# EAGLE design Own_21700_Board_v1.0_Final_AR (EAGLE 9.6.2)
COMPANY: ADAFRUIT INDUSTRIES; DRAWN: KTOWN; REV: A; YEAR: 2019
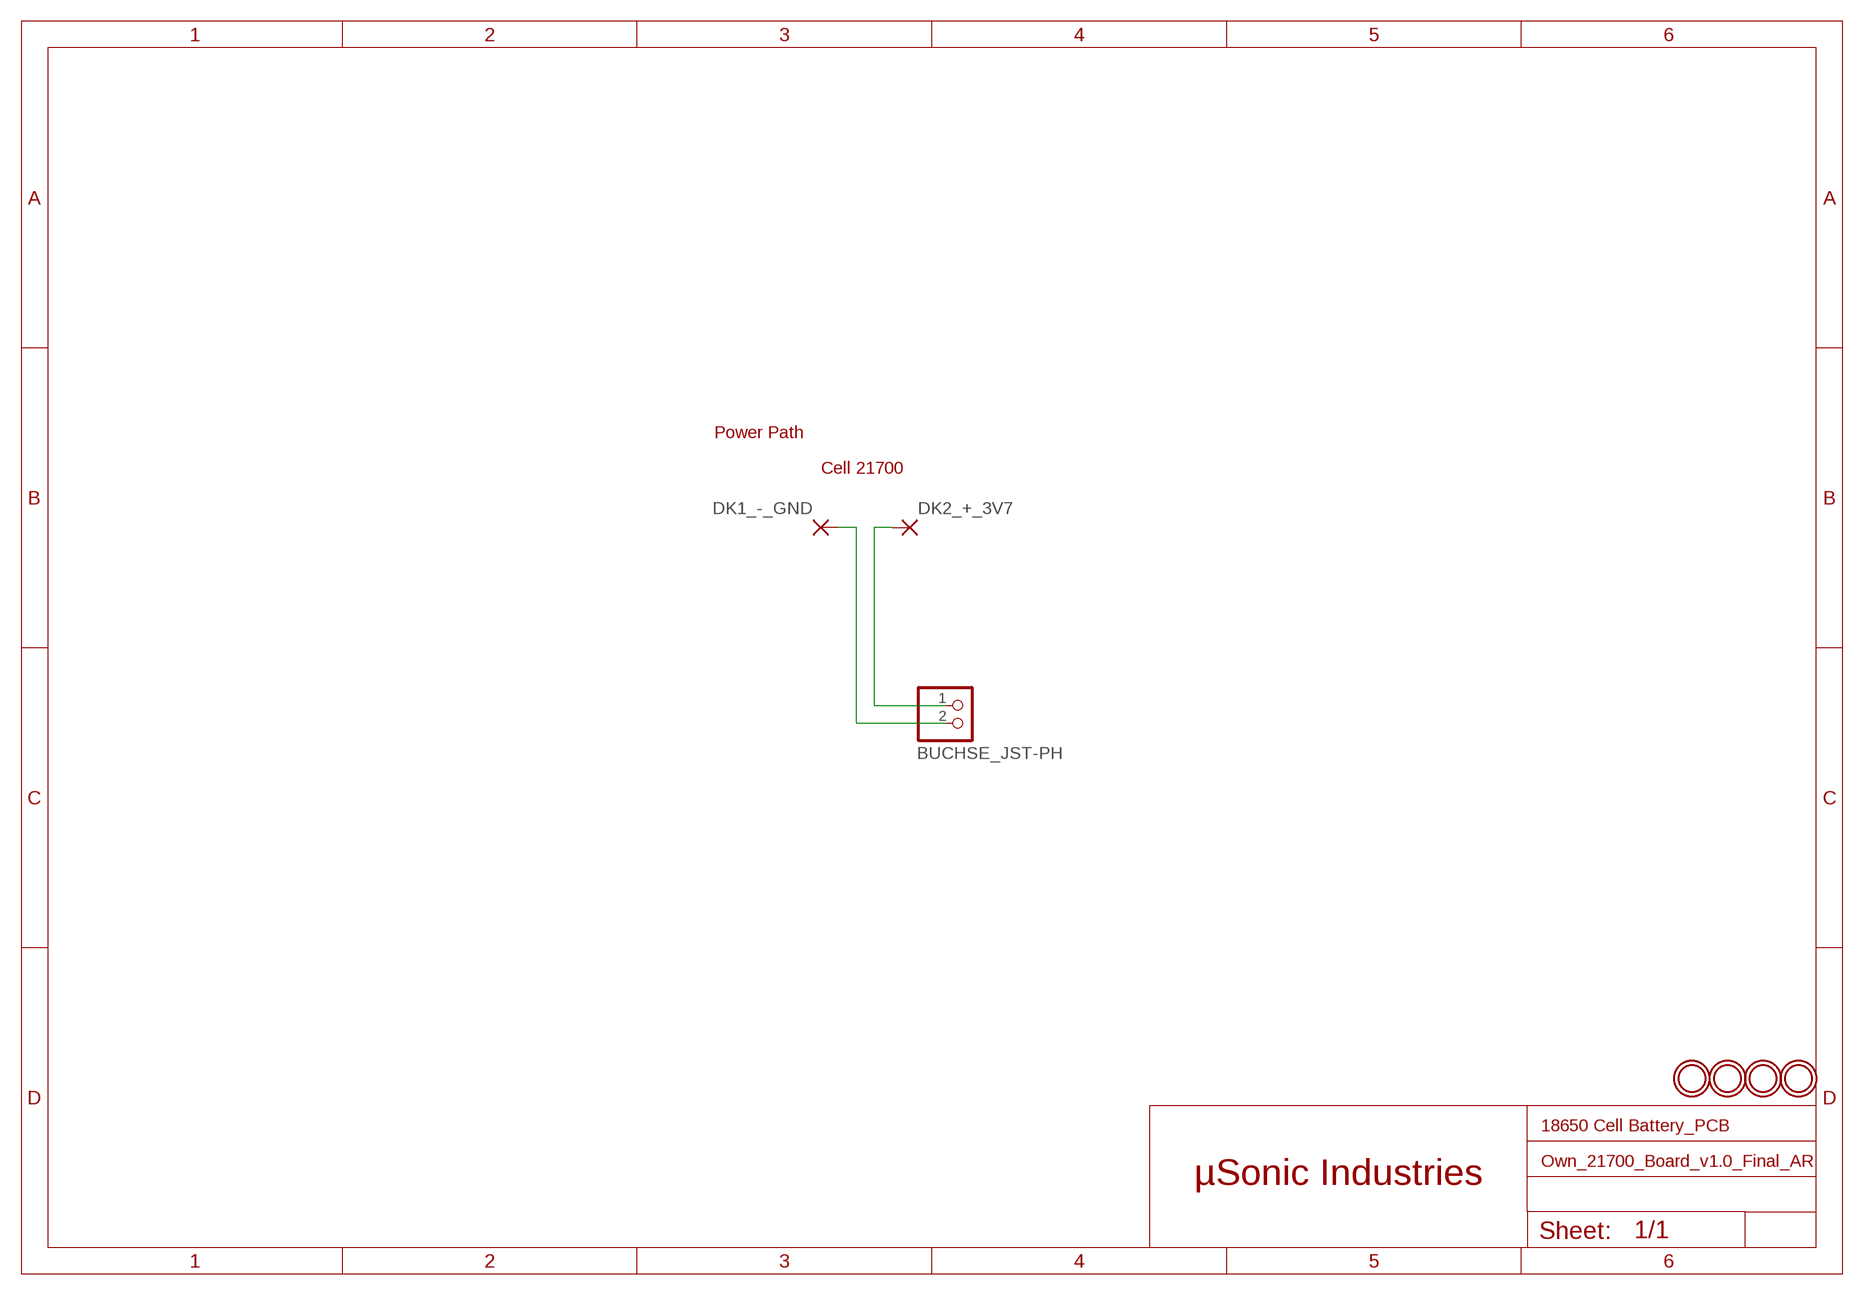
[diagram p0: schematic, sheet 1]

## Parts
BUCHSE_JST-PH  JST_2PINOWN  [JST-PH-2-THMOWN]
DK1_-_GND  3,17/1,3  [3,17/1,3]
DK2_+_3V7  3,17/1,3  [3,17/1,3]
U$1  MOUNTINGHOLE2.5  [MOUNTINGHOLE_2.5_PLATED]
U$2  MOUNTINGHOLE2.5  [MOUNTINGHOLE_2.5_PLATED]
U$3  MOUNTINGHOLE2.5  [MOUNTINGHOLE_2.5_PLATED]
U$5  MOUNTINGHOLE2.5  [MOUNTINGHOLE_2.5_PLATED]

## Nets
3V7: BUCHSE_JST-PH.1 DK2_+_3V7.1(P)
GND: BUCHSE_JST-PH.2 DK1_-_GND.1(P)

## Notes on the sheet
- Power Path
- Cell 21700
- 18650 Cell Battery_PCB
- µSonic Industries

## Library data of the parts
BUCHSE_JST-PH = adafruit2:JST_2PIN: JST 2-Pin Connectors of various flavors SMT-RA (S2B-PH-SM4) 4UConnector #17311 SMT (B2B-PH-SM4) THM-RA (S2B-PH) THM (B2B-PH)
DK1_-_GND DK2_+_3V7 = wirepad:3,17/1,3: THROUGH-HOLE PAD
U$1-U$3 U$5 = microbuilder:MOUNTINGHOLE: Mounting Hole For #2 screws (0.086"/2.18mm width, 0.094"/2.4mm hole) use 2.5mm; BOM: EXCLUDE

## Net classes
0 default: width 0.25 mm

## Board
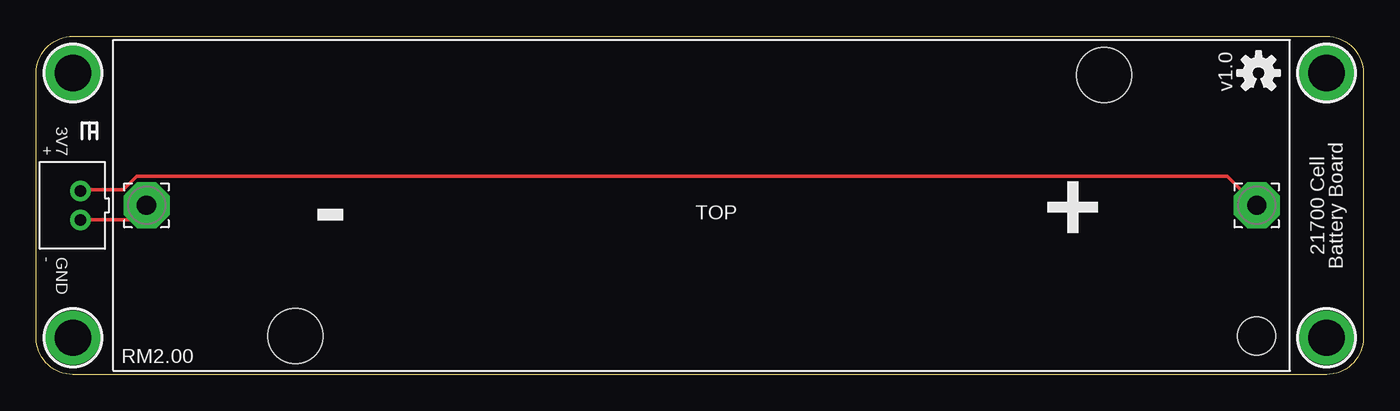
[diagram p1: board, top side]
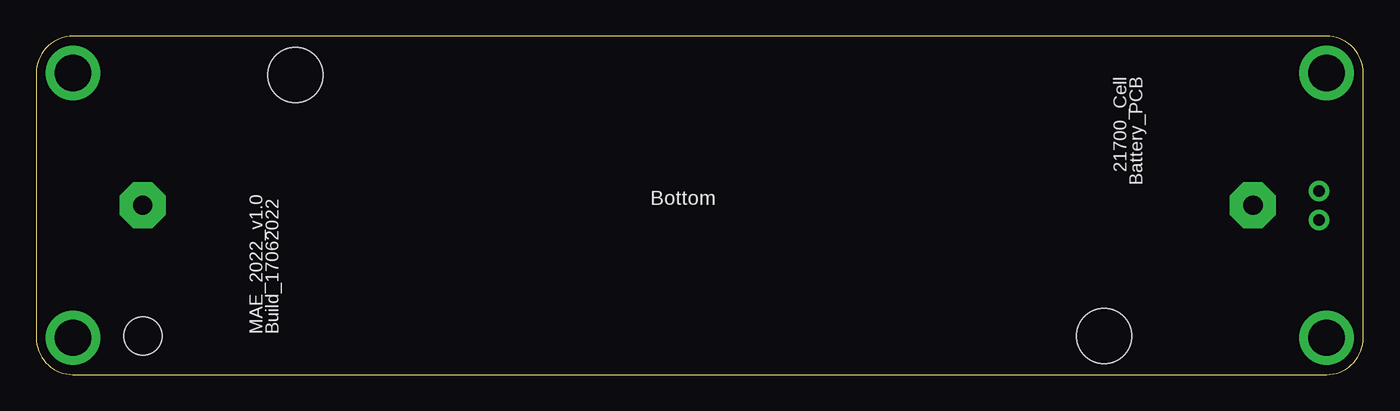
[diagram p2: board, bottom side, seen from below]

Size 91.69 x 23.37 mm. Coordinates in mm from the lower left corner, seen from the top.
Outline: 91.69,20.83 91.69,2.54 arc-90 89.15,0 2.54,0 arc-90 0,2.54 0,20.83 arc-90 2.54,23.37 89.15,23.37 arc-90 91.69,20.83
Copper layers (1*16): Top 0.035mm / dielectric 1.5mm / Bottom 0.035mm
Design rules "aisler_2_layer_complex": minimum track width 0.125mm, minimum drill 0.2mm, track to track 0.125mm, track to pad 0.125mm, pad to pad 0.125mm, via to via 0.125mm, smd to smd 0.125mm, copper to edge 0.3mm, drill to drill 0.25mm, minimum pad ring 0.2mm, minimum via ring 0.2mm, stop-mask expansion 0mil, vias tented up to drill 0mil, thermal gap 10mil
Holes 2.64 mm at 84.33,2.67
Holes 3.8 mm at 73.79,20.7 17.91,2.67

### Footprints (pad centres in the part's own frame; a part is rotated, then mirrored left to right if it is on the bottom)
JST-PH-2-THMOWN = drill 0.8 pad 1.422: 1 1,0; 2 -1,0
3,17/1,3 = drill 1.321 pad 3.175 octagon: 1 0,0
MOUNTINGHOLE_2.5_PLATED = drill 2.5 pad 3.2: P$1 0,0

### Placement (x,y rotation side)
BUCHSE_JST-PH  3.05,11.68 90 top
DK1_-_GND  7.62,11.68 0 top
DK2_+_3V7  84.33,11.68 0 top
U$1  89.15,20.83 180 top
U$2  2.54,20.83 180 top
U$3  89.15,2.54 0 top
U$4  [OSHW-LOGO-S]  84.45,20.83 0 top
U$5  2.54,2.54 0 top

### Tracks (layer width: path | path; a pad name or v marks a point on that pad's centre or on a via)
3V7
  Top 0.25: BUCHSE_JST-PH.1 3.19,12.75 6,12.75 6.94,13.69 82.31,13.69 84.19,11.81 DK2_+_3V7.1
GND
  Top 0.25: BUCHSE_JST-PH.2 3.19,10.69 6.56,10.69 7.5,11.62 DK1_-_GND.1

### Text on the board
tPlace: v1.0 | 3V7 / + | - | TOP | + | 21700 Cell / Battery Board | GND / - | RM2.00
bPlace: 21700_Cell / Battery_PCB | Bottom | MAE_2022_v1.0 / Build_17062022